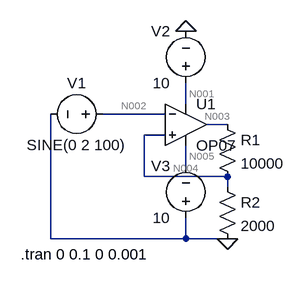
[diagram p0: schematic Schmit tigger.asc]
Schmit tigger.asc, the LTspice schematic file:
Version 4
SHEET 1 880 680
WIRE 208 128 208 96
WIRE 176 144 80 144
WIRE 272 160 240 160
WIRE 176 176 144 176
WIRE 208 224 208 192
WIRE 144 240 144 176
WIRE 272 240 144 240
WIRE 272 256 272 240
WIRE 0 336 0 144
WIRE 208 336 208 304
WIRE 208 336 0 336
WIRE 272 336 208 336
FLAG 272 336 0
FLAG 208 16 0
SYMBOL res 256 144 R0
SYMATTR InstName R1
SYMATTR Value 10000
SYMBOL res 256 240 R0
SYMATTR InstName R2
SYMATTR Value 2000
SYMBOL voltage 96 144 R90
WINDOW 0 -32 56 VBottom 2
WINDOW 3 32 56 VTop 2
WINDOW 123 0 0 Left 2
WINDOW 39 0 0 Left 2
SYMATTR InstName V1
SYMATTR Value SINE(0 2 100)
SYMBOL Opamps\\OP07 208 96 R0
SYMATTR InstName U1
SYMBOL voltage 208 112 R180
WINDOW 0 24 96 Left 2
WINDOW 3 24 16 Left 2
WINDOW 123 0 0 Left 2
WINDOW 39 0 0 Left 2
SYMATTR InstName V2
SYMATTR Value 10
SYMBOL voltage 208 320 R180
WINDOW 0 24 96 Left 2
WINDOW 3 24 16 Left 2
WINDOW 123 0 0 Left 2
WINDOW 39 0 0 Left 2
SYMATTR InstName V3
SYMATTR Value 10
TEXT -46 360 Left 2 !.tran 0 0.1 0 0.001

The netlist it stands for:
* Schmit tigger.asc
R1 N003 N004 10000
R2 N004 0 2000
V1 N002 0 SINE(0 2 100)
XU1 N004 N002 N001 N005 N003 LT1001  ; OP07, pins In+ In- V+ V- OUT
V2 N001 0 10
V3 0 N005 10
.tran 0 0.1 0 0.001
.lib LTC.lib
.backanno
.end

* Results of the author's LTspice run, read from the files saved beside the schematic
* Operating Point, zero values left out:
*   V(n001) = 10 V
*   V(n005) = -10 V
*   I(V3) = -2.25 mA
*   I(V2) = -2.25 mA
*   Ix(u1:3) = 2.25 mA
*   Ix(u1:4) = -2.25 mA
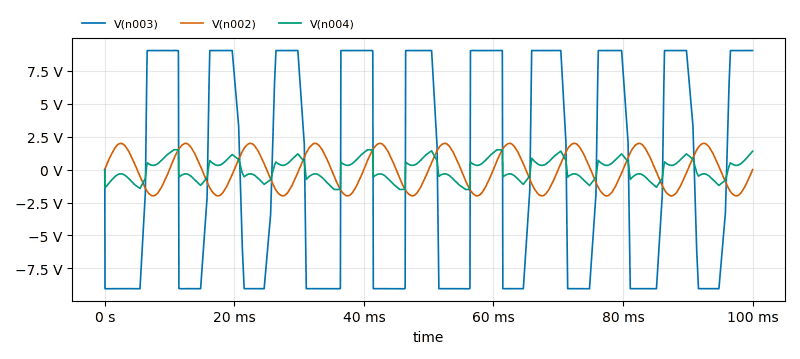
[diagram p1: Transient Analysis of Schmit tigger.asc, plotted from the saved traces]
* Transient Analysis, 1 run:
*   V(n003): min -9.05 V, max 9.055 V, average -55.3 mV, rms 8.6 V, last 9.043 V
*   V(n002): min -1.995 V, max 1.995 V, average -654.7 µV, rms 1.413 V, last 0 V
*   V(n004): min -1.508 V, max 1.509 V, average -8.938 mV, rms 832.4 mV, last 1.393 V